# Altium schematic sheet Sheet1.SchDoc
size A; SheetNumber: 1; SheetTotal: 1
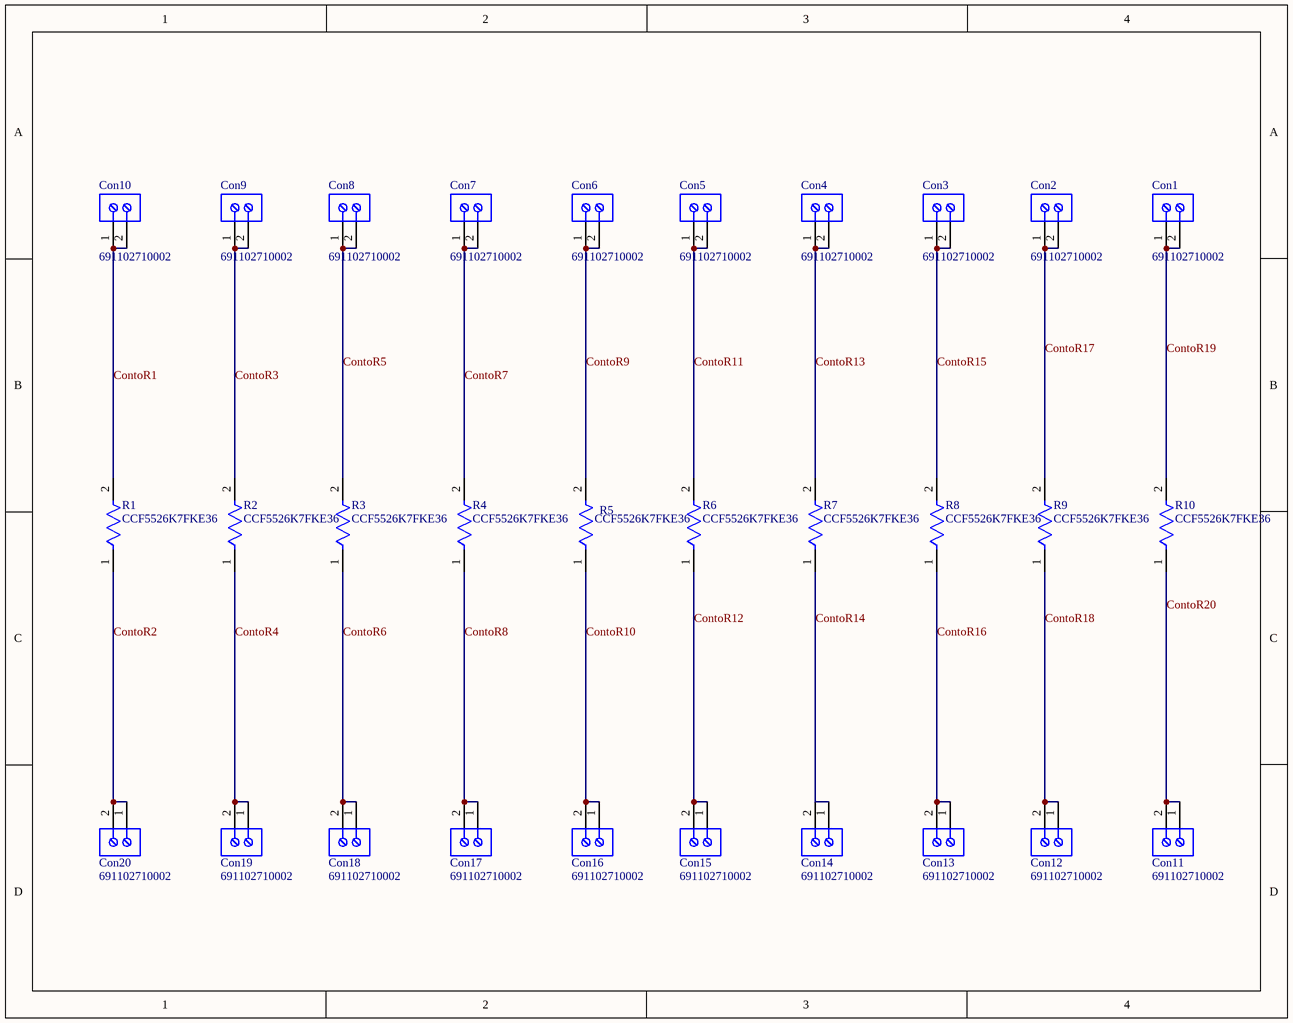
[diagram p0: Sheet1.SchDoc]

## Parts
Con1  691102710002  [691102710002]
Con2  691102710002  [691102710002]
Con3  691102710002  [691102710002]
Con4  691102710002  [691102710002]
Con5  691102710002  [691102710002]
Con6  691102710002  [691102710002]
Con7  691102710002  [691102710002]
Con8  691102710002  [691102710002]
Con9  691102710002  [691102710002]
Con10  691102710002  [691102710002]
Con11  691102710002  [691102710002]
Con12  691102710002  [691102710002]
Con13  691102710002  [691102710002]
Con14  691102710002  [691102710002]
Con15  691102710002  [691102710002]
Con16  691102710002  [691102710002]
Con17  691102710002  [691102710002]
Con18  691102710002  [691102710002]
Con19  691102710002  [691102710002]
Con20  691102710002  [691102710002]
R1  CCF5526K7FKE36  [FP-CCF55-MFG]
R2  CCF5526K7FKE36  [FP-CCF55-MFG]
R3  CCF5526K7FKE36  [FP-CCF55-MFG]
R4  CCF5526K7FKE36  [FP-CCF55-MFG]
R5  CCF5526K7FKE36  [FP-CCF55-MFG]
R6  CCF5526K7FKE36  [FP-CCF55-MFG]
R7  CCF5526K7FKE36  [FP-CCF55-MFG]
R8  CCF5526K7FKE36  [FP-CCF55-MFG]
R9  CCF5526K7FKE36  [FP-CCF55-MFG]
R10  CCF5526K7FKE36  [FP-CCF55-MFG]

## Nets
ContoR1: Con10.1 Con10.2 R1.2
ContoR2: Con20.1 Con20.2 R1.1
ContoR3: Con9.1 Con9.2 R2.2
ContoR4: Con19.1 Con19.2 R2.1
ContoR5: Con8.1 Con8.2 R3.2
ContoR6: Con18.1 Con18.2 R3.1
ContoR7: Con7.1 Con7.2 R4.2
ContoR8: Con17.1 Con17.2 R4.1
ContoR9: Con6.1 Con6.2 R5.2
ContoR10: Con16.1 Con16.2 R5.1
ContoR11: Con5.1 Con5.2 R6.2
ContoR12: Con15.1 Con15.2 R6.1
ContoR13: Con4.1 Con4.2 R7.2
ContoR14: Con14.1 Con14.2 R7.1
ContoR15: Con3.1 Con3.2 R8.2
ContoR16: Con13.1 Con13.2 R8.1
ContoR17: Con2.1 Con2.2 R9.2
ContoR18: Con12.1 Con12.2 R9.1
ContoR19: Con1.1 Con1.2 R10.2
ContoR20: Con11.1 Con11.2 R10.1

## Library data of the parts
Con1-Con20 = CMP-1502-03258-2: NexarPartId: 8917706; Number of Levels: 1; Number of Positions Per Level: 2; Current: 15A; Voltage: 300V; Pitch: 5.0038mm; Plating: Steel; Stripping Length: -6mm; Wire Gauge (Min): 14AWG; Wire Gauge (Max): 22AWG; Length: 7.5mm; Contact Material: Brass; Contact Plating: Tin; Packaging: Box; Number of Pins: 2; Voltage Rating: 300V; Termination: Screw; Number of Contacts: 2; Color: Blue; Current Rating: 15A; Mount: Through Hole; Max Operating Temperature: 105°C; Min Operating Temperature: -40°C; REACH SVHC: Unknown; Height: 13.4mm; Width: 11.2mm; Housing Material: Nylon; RoHS: Compliant; Wire/Cable Gauge: 22AWG; Lead Pitch: 5mm
R1-R10 = CMP-00030-42465748-1: CCF5526K7FKE36 Res Metal Film 26.7K Ohm 1% 1/4W 1/2W ±100ppm/°C Conformal AXL Thru-Hole T/R; Voltage Rating: 250V; Lead Diameter: 640µm; Power Rating: 500mW; Resistance: 26.7kΩ; RoHS: Compliant; Max Operating Temperature: 165°C; Length: 6.73mm; Lead Free: Lead Free; Tolerance: 1%; Min Operating Temperature: -65°C; Radiation Hardening: No; Mount: Through Hole; Temperature Coefficient: 100ppm/°C; Termination: Axial; NexarPartId: 42465748; Composition: Metal Film; Diameter: 2.29mm; Military Standard: Not; Case/Package: Conformal; Contact Plating: Tin